# EAGLE schematic esquema sensor (EAGLE 8.6.0)
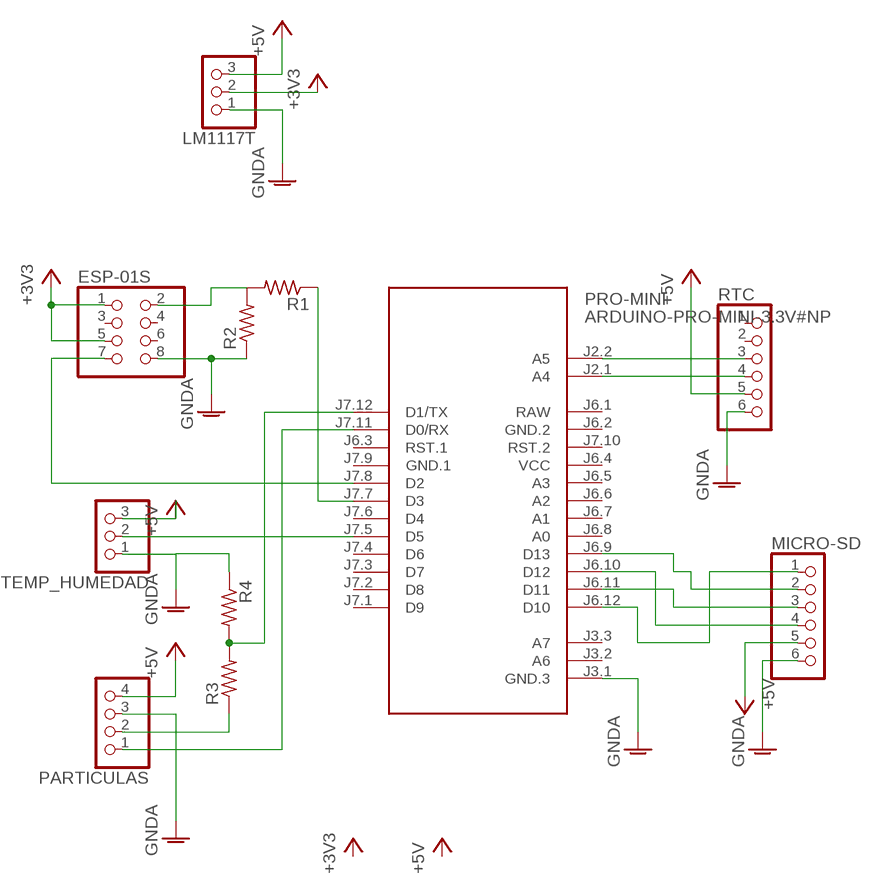
[diagram p0: schematic, sheet 1]

## Parts
ESP-01S  PINHD-2X4  [2X04]
LM1117T  PINHD-1X3  [1X03]
MICRO-SD  PINHD-1X6B  [1X06-BIG]
PARTICULAS  PINHD-1X4  [1X04]
PRO-MINI  ARDUINO-PRO-MINI-3.3V#NP  [ARDUINO-PRO-MINI#NP]
R1  R-US_0207/7  [0207/7]
R2  R-US_0207/7  [0207/7]
R3  R-US_0207/7  [0207/7]
R4  R-US_0207/7  [0207/7]
RTC  PINHD-1X6B  [1X06-BIG]
TEMP_HUMEDAD  PINHD-1X3  [1X03]

## Nets
+3V3: ESP-01S.1 ESP-01S.5 LM1117T.2
+5V: LM1117T.3 MICRO-SD.5 PARTICULAS.4 RTC.5 TEMP_HUMEDAD.3
GNDA: ESP-01S.8 LM1117T.1 MICRO-SD.6 PARTICULAS.3 PRO-MINI.J3.1(GND.3) R2.1 R4.1 RTC.6 TEMP_HUMEDAD.1
N$1: PRO-MINI.J7.7(D3) R1.1
N$2: PRO-MINI.J2.1(A4) RTC.4
N$3: ESP-01S.7 PRO-MINI.J7.8(D2)
N$4: ESP-01S.2 R1.2 R2.2
N$5: PARTICULAS.1 PRO-MINI.J7.11(D0/RX)
N$6: PRO-MINI.J7.12(D1/TX) R3.2 R4.2
N$7: PARTICULAS.2 R3.1
N$8: PRO-MINI.J7.5(D5) TEMP_HUMEDAD.2
N$9: PRO-MINI.J2.2(A5) RTC.3
N$10: MICRO-SD.4 PRO-MINI.J6.10(D12)
N$11: MICRO-SD.3 PRO-MINI.J6.11(D11)
N$12: MICRO-SD.2 PRO-MINI.J6.9(D13)
N$13: MICRO-SD.1 PRO-MINI.J6.12(D10)
Unconnected: ESP-01S.3 ESP-01S.4 ESP-01S.6 PRO-MINI.J3.2(A6) PRO-MINI.J3.3(A7) PRO-MINI.J6.3(RST.1) PRO-MINI.J6.5(A3) PRO-MINI.J6.6(A2) PRO-MINI.J6.7(A1) PRO-MINI.J6.8(A0) PRO-MINI.J7.1(D9) PRO-MINI.J7.2(D8) PRO-MINI.J7.3(D7) PRO-MINI.J7.4(D6) PRO-MINI.J7.6(D4) PRO-MINI.J7.10(RST.2) RTC.1 RTC.2

## Power pins joined to a net without a drawn wire
GND.1: PRO-MINI.J7.9(GND.1)
GND.2: PRO-MINI.J6.2(GND.2)
RAW: PRO-MINI.J6.1(RAW)
VCC: PRO-MINI.J6.4(VCC)

## Library data of the parts
ESP-01S = pinhead:PINHD-2X4: PIN HEADER
LM1117T TEMP_HUMEDAD = adafruit:PINHD-1X3: PIN HEADER
MICRO-SD RTC = adafruit:PINHD-1X6: PIN HEADER
PARTICULAS = pinhead:PINHD-1X4: PIN HEADER
PRO-MINI = diy-modules:ARDUINO-PRO-MINI-*#NP: Arduino Pro Mini (and compatible devices) without programming pads More details available here: https://www.arduino.cc/en/Main/ArduinoBoardProMini Click here to find device on ebay.com <http://www.ebay.com/sch/arduino+pro+mini>
R1-R4 = resistor:R-US_: RESISTOR, American symbol